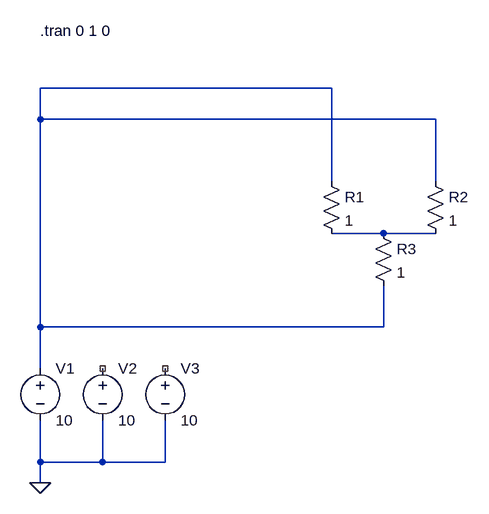
[diagram p0: schematic 2025-08-27 Wye vs Delta.asc]
2025-08-27 Wye vs Delta.asc, the LTspice schematic file:
Version 4.1
SHEET 1 880 680
WIRE 320 -176 -128 -176
WIRE -128 -128 -128 -176
WIRE 480 -128 -128 -128
WIRE 320 -32 320 -176
WIRE 480 -32 480 -128
WIRE 400 48 320 48
WIRE 480 48 400 48
WIRE -128 192 -128 -128
WIRE 400 192 400 128
WIRE 400 192 -128 192
WIRE -128 256 -128 192
WIRE -128 400 -128 336
WIRE -32 400 -32 336
WIRE -32 400 -128 400
WIRE 64 400 64 336
WIRE 64 400 -32 400
WIRE -128 432 -128 400
FLAG -128 432 0
SYMBOL res 304 -48 R0
SYMATTR InstName R1
SYMATTR Value 1
SYMBOL res 464 -48 R0
SYMATTR InstName R2
SYMATTR Value 1
SYMBOL res 384 32 R0
SYMATTR InstName R3
SYMATTR Value 1
SYMBOL voltage -128 240 R0
WINDOW 123 0 0 Left 0
WINDOW 39 0 0 Left 0
SYMATTR InstName V1
SYMATTR Value 10
SYMBOL voltage -32 240 R0
WINDOW 123 0 0 Left 0
WINDOW 39 0 0 Left 0
SYMATTR InstName V2
SYMATTR Value 10
SYMBOL voltage 64 240 R0
WINDOW 123 0 0 Left 0
WINDOW 39 0 0 Left 0
SYMATTR InstName V3
SYMATTR Value 10
TEXT -128 -264 Left 2 !.tran 0 1 0

The netlist it stands for:
* 2025-08-27 Wye vs Delta.asc
R1 N001 N002 1
R2 N001 N002 1
R3 N002 N001 1
V1 N001 0 10
V2 NC_01 0 10
V3 NC_02 0 10
.tran 0 1 0
.backanno
.end